# EasyEDA Pro project ESP32_wroom_B.eprj

# Schematic LED_board
Create Date: 2025-08-18; Page Name: P1; Project Name: ESP32_wroom_B; Schematic Name: LED_board; Update Date: 2025-08-20; Company: 嘉立创EDA; Page Size: A4; Version: V1.0
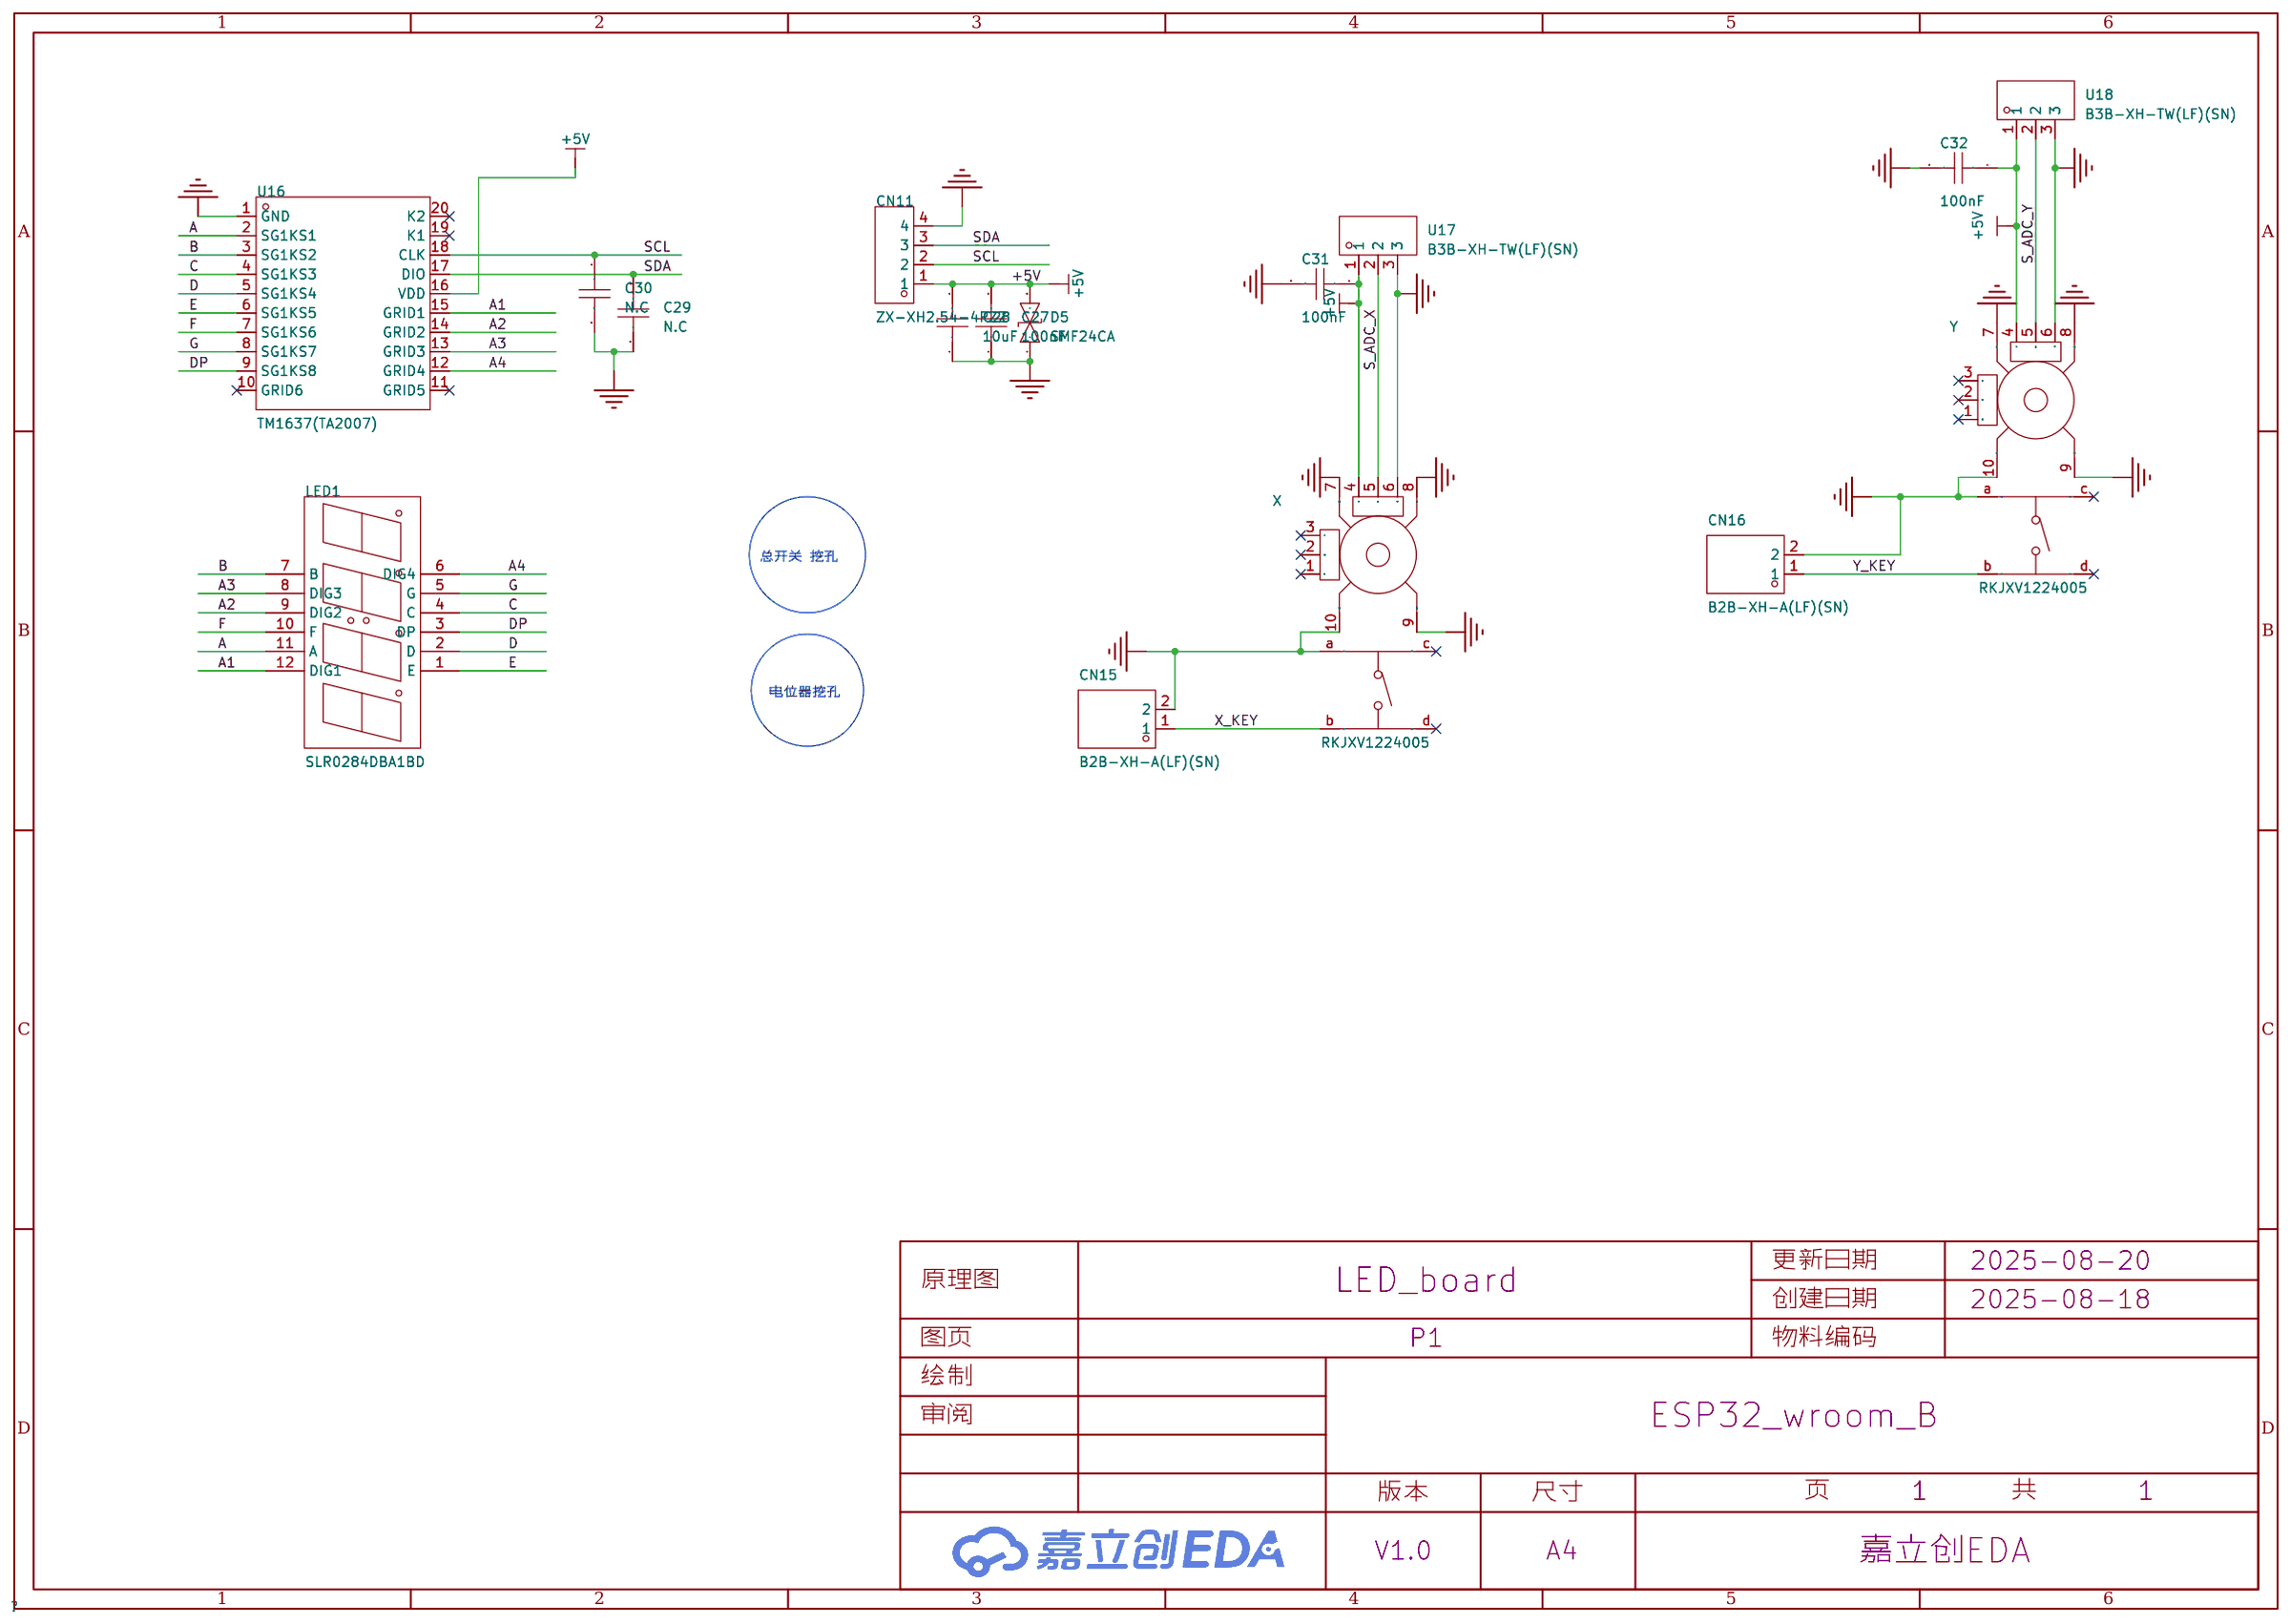
[diagram p0: schematic sheet]

## Parts
C27  100nF  [C0603]
C28  10uF  [C0603]
C29  N.C  [C0603]
C30  N.C  [C0603]
C31  100nF  [C0603]
C32  100nF  [C0603]
CN11  ZX-XH2.54-4PZZ  [CONN-TH_4P-P2.50_4PIN]
CN15  B2B-XH-A(LF)(SN)  [CONN-TH_B2B-XH-A-LF-SN]
CN16  B2B-XH-A(LF)(SN)  [CONN-TH_B2B-XH-A-LF-SN]
D5  SMF24CA  [SOD-123FL_L2.7-W1.8-LS3.8-BI]
LED1  SLR0284DBA1BD  [LED-SEG-TH_12P-L32.1-W10.0-P2.54-S7.62-BL]
U16  TM1637(TA2007)  [SOP-20_L12.8-W7.5-P1.27-LS10.4-BL]
U17  B3B-XH-TW(LF)(SN)  [CONN-TH_B3B-XH-TW-LF-SN]
U18  B3B-XH-TW(LF)(SN)  [CONN-TH_B3B-XH-TW-LF-SN]
X  RKJXV1224005  [SW-TH_RKJXV1224005]
Y  RKJXV1224005  [SW-TH_RKJXV1224005]

## Library data of the parts
C27-C32 = CGA0603X7R104K500JT: 容值:100nF;精度:±10%;额定电压:50V;温度系数:X7R;; LCSC Part Name: 100nF ±10% 50V; Supplier Part: C6119867; Manufacturer: HRE(芯声); Supplier Footprint: 0603; JLCPCB Part Class: 扩展库; Datasheet: https://atta.szlcsc.com/upload/public/pdf/source/20250103/C44077DA9E7B3EFAE02F22B6D3D1CBC9.pdf; Supplier: LCSC; Tolerance: ±10%; Voltage Rating: 50V; Temperature Coefficient: X7R
CN11 = ZX-XH2.54-4PZZ: 插针结构:1x4P;间距:2.5mm;安装方式:直插;参考系列:XH;总PIN数:4P;排数:1;每排PIN数:4;行距:-;额定电流:3A;触头材质:黄铜;触头镀层:锡;工作温度:-25℃~+85℃;; LCSC Part Name: 1x4P 间距:2.5mm 直插 系列:XH; Supplier Part: C7429634; Manufacturer: Megastar(兆星); Supplier Footprint: 插件,P=2.5mm; JLCPCB Part Class: 扩展库; Datasheet: https://item.szlcsc.com/datasheet/ZX-XH2.54-4PZZ/8427551.html; Supplier: LCSC; Pins Structure: 1x4P; Pitch: 2.5mm; Mounting Type: 直插; Reference Series: XH; Number of Pins: 4P; Number of Rows: 1; Number of PINs Per Row: 4; Current Rating: 3A; Contact Material: 黄铜; Contact Plating: 锡; Operating Temperature: -25℃~+85℃; Voltage Rating: 250V; Plastic Material: PA66; Flame Retardant Rating: UL94V-0; Color: 白色; Z-Height of the Board: 7mm; X-Length of Bottom Edge on Board (Spacing Line): 12.5mm; Y-Width of Bottom Edge on Board: 5.9mm
CN15 CN16 = B2B-XH-A(LF)(SN): 插针结构:1x2P;间距:2.5mm;安装方式:直插;参考系列:XH;总PIN数:2P;排数:1;每排PIN数:2;行距:-;额定电流:3A;触头材质:黄铜;触头镀层:锡;工作温度:-25℃~+85℃;; LCSC Part Name: 1x2P 间距:2.5mm 直插 系列:XH; Supplier Part: C158012; Manufacturer: JST; Supplier Footprint: 插件,P=2.5mm; JLCPCB Part Class: 扩展库; Datasheet: https://item.szlcsc.com/datasheet/B2B-XH-A(LF)(SN)/169360.html; Supplier: LCSC; Pins Structure: 1x2P; Pitch: 2.5mm; Mounting Type: 直插; Reference Series: XH; Number of Pins: 2P; Number of Rows: 1; Number of PINs Per Row: 2; Current Rating: 3A; Contact Material: 黄铜; Contact Plating: 锡; Operating Temperature: -25℃~+85℃; Voltage Rating: 250V; Plastic Material: PA66; Flame Retardant Rating: UL94V-0; Supplementary Features: 打K脚; Color: 白色; Z-Height of the Board: 7mm; X-Length of Bottom Edge on Board (Spacing Line): 7.4mm; Y-Width of Bottom Edge on Board: 5.75mm
D5 = SMF24CA_C19077515: 极性:双向;反向截止电压(Vrwm):24V;最大钳位电压:38.9V;峰值脉冲电流(Ipp)@10/1000us:5.1A;峰值脉冲功率(Ppp)@10/1000us:200W;击穿电压:29.5V;; Supplier Part: C19077515; Manufacturer: 宏迦橙; Supplier Footprint: SOD-123FL; JLCPCB Part Class: 扩展库; Datasheet: https://atta.szlcsc.com/upload/public/pdf/source/20231129/4813F17DC56F8B344A8D004597B3633C.pdf; Supplier: LCSC; polarity: 双向; Reverse Stand-Off Voltage (Vrwm): 24V; Maximum Clamping Voltage: 38.9V; Peak Pulse Current (Ipp)@10/1000us: 5.1A; Peak Pulse Power Dissipation (Ppp)@10/1000us: 200W; Breakdown Voltage: 29.5V; Reverse Leakage Current (Ir): 1uA; Operating Temperature: -55℃~+155℃; Type: TVS
LED1 = SLR0284DBA1BD_C2913024: LCSC Part Name: 0.28英寸,四位,蓝光,共阳LED数码管,插件; Supplier Part: C2913024; Manufacturer: SUNLIGHT(光华); Supplier Footprint: 插件; JLCPCB Part Class: 扩展库; Datasheet: https://atta.szlcsc.com/upload/public/pdf/source/20180720/C225887_0F684DEC51BA632F3B2058A569976876.pdf; Supplier: LCSC
U16 = TM1637(TA2007): LCSC Part Name: LED驱动控制专用电路; Supplier Part: C5337160; Manufacturer: TM(天微); Supplier Footprint: SOP-20; JLCPCB Part Class: 扩展库; Datasheet: https://item.szlcsc.com/datasheet/TM1637(TA2007)/6103284.html; Supplier: LCSC
U17 U18 = B3B-XH-TW(LF)(SN): 插针结构:1x3P;间距:2.5mm;安装方式:-;参考系列:XH;总PIN数:3P;排数:1;每排PIN数:3;行距:-;额定电流:3A;工作温度范围:-25℃~+85℃;; LCSC Part Name: 1x3P 间距:2.5mm 系列:XH; Supplier Part: C594199; Manufacturer: JST; Supplier Footprint: P=2.5mm; JLCPCB Part Class: 扩展库; Datasheet: https://atta.szlcsc.com/upload/public/pdf/source/20210915/55C2150F8D01CCBD7F61D7DC07E45ED6.pdf; Supplier: LCSC; Pins Structure: 1x3P; Pitch: 2.5mm; Reference Series: XH; Number of Pins: 3P; Number of Rows: 1; Number of PINs Per Row: 3; Current Rating (Max): 3A; Operating Temperature Range: -25℃~+85℃; Rated Voltage (Max): 250V; Colour: 白色
X Y = RKJXV1224005: 操纵杆复位 中央按动开关 适用于航模玩具遥控器电位器、3D摇杆PS4手柄游戏机、无人机摇杆电位器、工业控制器; Supplier Part: C146170; Manufacturer: ALPSALPINE(阿尔卑斯阿尔派); Supplier Footprint: 插件,13x13mm; JLCPCB Part Class: 扩展库; Datasheet: https://atta.szlcsc.com/upload/public/pdf/source/20180125/C146170_15168615510911301620.pdf; Supplier: LCSC

## Nets
+5V: C27.2 C28.2 C31.1 C32.1 CN11.1 D5.2(A) U16.16(VDD) U17.1 U18.1 X.4(A) Y.4(A)
GND: C27.1 C28.1 C29.2 C30.2 C31.2 C32.2 CN11.4 CN15.2 CN16.2 D5.1(K) U16.1(GND) U17.3 U18.3 X.6(B) X.7(GND) X.8(GND) X.9(GND) X.10(GND) X.a Y.6(B) Y.7(GND) Y.8(GND) Y.9(GND) Y.10(GND) Y.a
A: LED1.11(A) U16.2(SG1KS1)
A1: LED1.12(DIG1) U16.15(GRID1)
A2: LED1.9(DIG2) U16.14(GRID2)
A3: LED1.8(DIG3) U16.13(GRID3)
A4: LED1.6(DIG4) U16.12(GRID4)
B: LED1.7(B) U16.3(SG1KS2)
C: LED1.4(C) U16.4(SG1KS3)
D: LED1.2(D) U16.5(SG1KS4)
DP: LED1.3(DP) U16.9(SG1KS8)
E: LED1.1(E) U16.6(SG1KS5)
F: LED1.10(F) U16.7(SG1KS6)
G: LED1.5(G) U16.8(SG1KS7)
S_ADC_X: U17.2 X.5(DTA)
S_ADC_Y: U18.2 Y.5(DTA)
SCL: C30.1 CN11.2 U16.18(CLK)
SDA: C29.1 CN11.3 U16.17(DIO)
X_KEY: CN15.1 X.b
Y_KEY: CN16.1 Y.b

Not connected (* = marked no-connect by the designer): U16 10(GRID6)* 11(GRID5)* 19(K1)* 20(K2)*; X 1(B)* 2(DTA)* 3(A)* c* d*; Y 1(B)* 2(DTA)* 3(A)* c* d*

## Notes on the sheet
- 总开关 挖孔
- 电位器挖孔

# Board PCB1
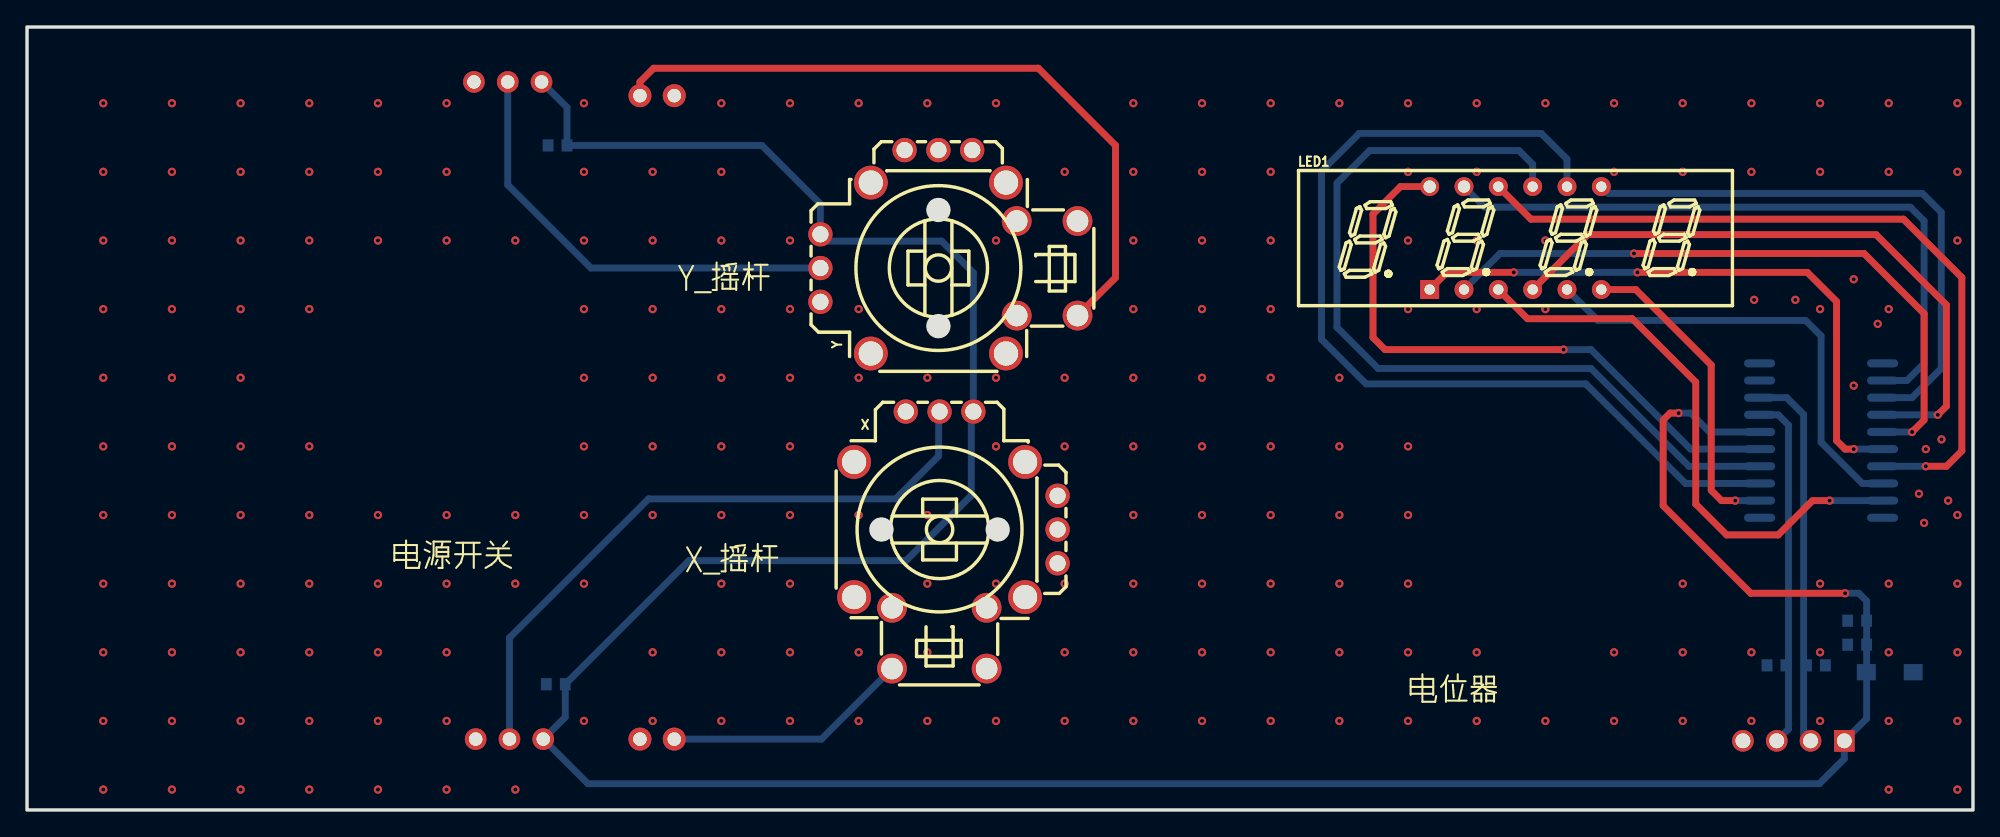
[diagram p1: board, top side]
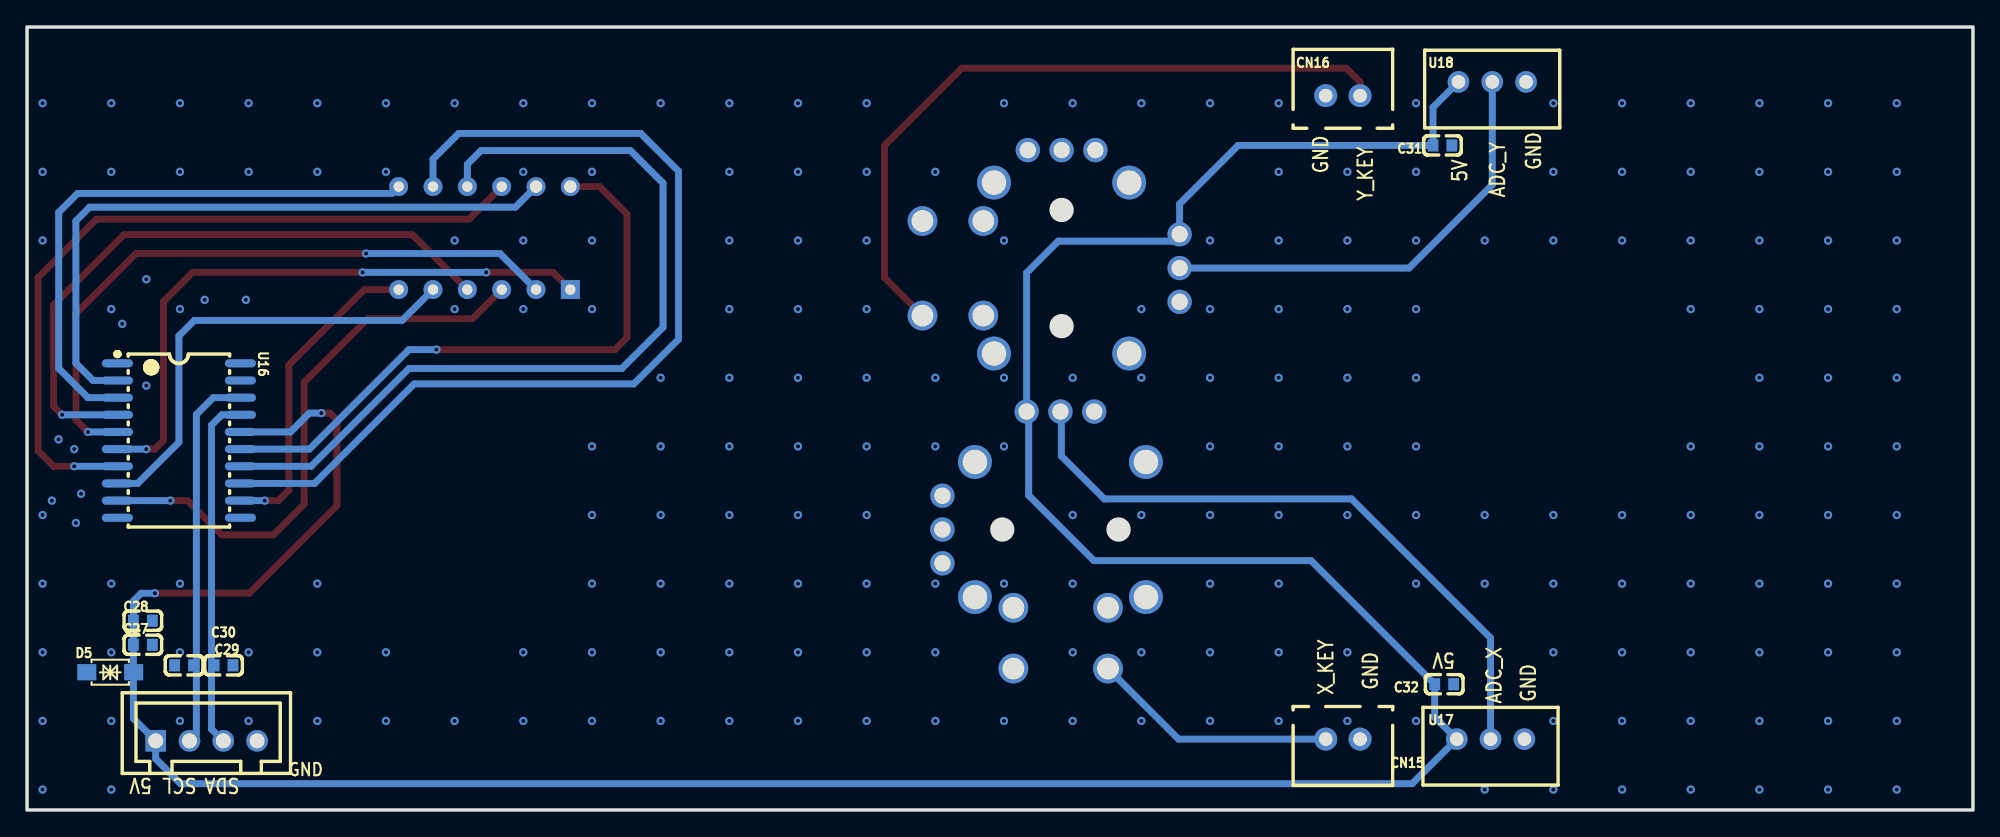
[diagram p2: board, bottom side, seen from below]

Outline 143.95 x 57.95 mm; copper layers: Top Layer, Bottom Layer. Coordinates in mm from the lower left corner of the outline.
Outline path: rectangle 0,57.95 143.95,0
Stack: Top Layer 0.035mm / Dielectric1 1.51mm FR4 er 4.5 / Bottom Layer 0.035mm

## Design rules (mm)
template: 自定义配置
spacing copperThickness1oz (default): track to track 0.102, other pairs 0.152 to 0.508
spacing copperThickness2oz: track to track 0.203, other pairs 0.152 to 0.3
track width copperThickness1oz (default): min 0.127, default 0.254, max 2.54
track width copperThickness2oz: min 0.203, default 0.254, max 2.54
differential pair differentialPair (default): width min 0.127, default 0.254, max 2.54; gap min 0.152, default 0.152
via viaSize (default): diameter min 0.5, default 0.61, max 10; hole min 0.3, default 0.305, max 6.299

## Placement (name value [footprint] x y rotation side)
C27  100nF  [C0603]  135.38 12.23 0 bottom
C28  10uF  [C0603]  135.38 14.01 0 bottom
C29  N.C  [C0603]  129.41 10.71 180 bottom
C30  N.C  [C0603]  132.33 10.71 0 bottom
C31  100nF  [C0603]  39.24 49.19 180 bottom
C32  100nF  [C0603]  39.12 9.31 180 bottom
CN15  B2B-XH-A(LF)(SN)  [CONN-TH_B2B-XH-A-LF-SN]  46.61 5.24 0 bottom
CN16  B2B-XH-A(LF)(SN)  [CONN-TH_B2B-XH-A-LF-SN]  46.61 52.87 180 bottom
D5  SMF24CA  [SOD-123FL_L2.7-W1.8-LS3.8-BI]  137.79 10.2 180 bottom
GND  ZX-XH2.54-4PZZ  [CONN-TH_4P-P2.50_4PIN]  130.68 5.12 180 bottom
LED1  SLR0284DBA1BD  [LED-SEG-TH_12P-L32.1-W10.0-P2.54-S7.62-BL]  110.11 42.33 0 top
U16  TM1637(TA2007)  [SOP-20_L12.8-W7.5-P1.27-LS10.4-BL]  132.72 27.34 270 bottom
U17  B3B-XH-TW(LF)(SN)  [CONN-TH_B3B-XH-TW-LF-SN]  35.69 5.24 180 bottom
U18  B3B-XH-TW(LF)(SN)  [CONN-TH_B3B-XH-TW-LF-SN]  35.56 53.89 180 bottom
X  RKJXV1224005  [SW-TH_RKJXV1224005]  68.71 19.98 0 top
Y  RKJXV1224005  [SW-TH_RKJXV1224005]  68.2 41.31 90 top

## Footprints (pads in the part's own frame, mm; a bottom-side part is the same pattern mirrored in y, then rotated)
C0603
  rect 0.8x0.9 smd: 1(-0.7,0) 2(0.7,0)
CONN-TH_4P-P2.50_4PIN
  rect 1.524x1.6 hole 1.1: 1(-3.75,0)
  round 1.6 hole 1.1: 2(-1.25,0) 3(1.25,0) 4(3.75,0)
CONN-TH_B2B-XH-A-LF-SN
  round 1.7 hole 1: 1(1.27,0) 2(-1.27,0)
CONN-TH_B3B-XH-TW-LF-SN
  round 1.6 hole 1: 1(-2.5,0) 2(0,0) 3(2.5,0)
LED-SEG-TH_12P-L32.1-W10.0-P2.54-S7.62-BL
  rect 1.4x1.4 hole 0.762: 1(-6.35,-3.81)
  round 1.4 hole 0.762: 2(-3.81,-3.81) 3(-1.27,-3.81) 4(1.27,-3.81) 5(3.81,-3.81) 6(6.35,-3.81) 7(6.35,3.81) 8(3.81,3.81) 9(1.27,3.81) 10(-1.27,3.81)
  round 1.4 hole 0.914: 11(-3.81,3.81) 12(-6.35,3.81)
SOD-123FL_L2.7-W1.8-LS3.8-BI
  rect 1.4x1.2 smd: 1(-1.735,0) 2(1.735,0)
SOP-20_L12.8-W7.5-P1.27-LS10.4-BL
  oval 0.6x2.3 smd: 1(-5.715,-4.55) 2(-4.445,-4.55) 3(-3.175,-4.55) 4(-1.905,-4.55) 5(-0.635,-4.55) 6(0.635,-4.55) 7(1.905,-4.55) 8(3.175,-4.55) 9(4.445,-4.55) 10(5.715,-4.55) 11(5.715,4.55) 12(4.445,4.55) 13(3.175,4.55) 14(1.905,4.55) 15(0.635,4.55) 16(-0.635,4.55) 17(-1.905,4.55) 18(-3.175,4.55) 19(-4.445,4.55) 20(-5.715,4.55)
SW-TH_RKJXV1224005
  round 1.8 hole 1.2: 1(7.527,-1.719) 2(7.527,0.781) 3(7.527,3.281) 4(1.298,9.511) 5(-1.202,9.511) 6(-3.703,9.511)
  round 2.5 hole 1.8: 7(-7.527,5.781) 8(-7.527,-4.219) 9(5.122,-4.219) 10(5.122,5.781)
  round 2.2 hole 1.6: a(-4.721,-5.011) b(-4.721,-9.511) c(2.279,-5.011) d(2.279,-9.511)

## Nets
As in the schematic, except:
+5V: C27.2 C28.2 C31.1 C32.1 D5.2 GND.1 U16.16 U17.1 U18.1 X.4 Y.4
GND: C27.1 C28.1 C29.2 C30.2 C31.2 C32.2 CN15.2 CN16.2 D5.1 GND.4 U16.1 U17.3 U18.3 X.6 X.7 X.8 X.9 X.10 X.a Y.6 Y.7 Y.8 Y.9 Y.10 Y.a
SCL: C30.1 GND.2 U16.18
SDA: C29.1 GND.3 U16.17

Pads without a net: U16 10 11 19 20; X 1 2 3 c d; Y 1 2 3 c d

## Via types
v1: diameter 0.61, hole 0.305, Top Layer to Bottom Layer, 22 vias
v2: diameter 0.61, hole 0.304, Top Layer to Bottom Layer, 213 vias

## Routing (per net, layer and track width the routed paths; a pad name or vN(x,y) marks a point on that pad's centre or on a via; arc(x,y) is an arc through that point)
+5V: length 240.8
  Top Layer w0.508: v1(134.49,16.04) 127.51,16.04 121.03,22.52 121.03,28.87 121.54,29.37 v1(122.17,29.37)
  Bottom Layer w0.508: U16.16 124.46,27.98 123.06,29.37 v1(122.17,29.37) ; U18.1 39.94,52 C31.1 54.36,49.19 58.69,44.85 Y.4 59.2,42.1 67.66,42.1 70,39.76 X.4 69.85,29.33 69.85,23.28 65.02,18.45 48.96,18.45 C32.1 39.82,6.87 U17.1 41.49,1.94 132.59,1.94 134.43,3.79 GND.1 136.08,6.77 136.08,15.47 135.51,16.04 v1(134.49,16.04)
GND:
  vias: v1(127.76,37.76) v1(130.81,37.76) v1(135.13,39.28) v1(135.13,31.41) v1(136.91,35.98) v1(139.95,23.41) v1(140.34,21.25) v1(140.46,26.71) v1(141.62,27.43) v1(142.11,22.9) v2(5.64,52.31) v2(5.64,47.23) v2(5.64,42.15) v2(5.64,37.07) v2(5.64,31.99) v2(5.64,26.91) v2(5.64,21.83) v2(5.64,16.75) v2(5.64,11.67) v2(5.64,6.59) v2(5.64,1.51) v2(10.72,52.31) v2(10.72,47.23) v2(10.72,42.15) v2(10.72,37.07) v2(10.72,31.99) v2(10.72,26.91) v2(10.72,21.83) v2(10.72,16.75) v2(10.72,11.67) v2(10.72,6.59) v2(10.72,1.51) v2(15.8,52.31) v2(15.8,47.23) v2(15.8,42.15) v2(15.8,37.07) v2(15.8,31.99) v2(15.8,26.91) v2(15.8,21.83) v2(15.8,16.75) v2(15.8,11.67) v2(15.8,6.59) v2(15.8,1.51) v2(20.88,52.31) v2(20.88,47.23) v2(20.88,42.15) v2(20.88,37.07) v2(20.88,26.91) v2(20.88,21.83) v2(20.88,16.75) v2(20.88,11.67) v2(20.88,6.59) v2(20.88,1.51) v2(25.96,52.31) v2(25.96,47.23) v2(25.96,42.15) v2(25.96,21.83) v2(25.96,16.75) v2(25.96,11.67) v2(25.96,6.59) v2(25.96,1.51) v2(31.04,52.31) v2(31.04,47.23) v2(31.04,42.15) v2(31.04,21.83) v2(31.04,16.75) v2(31.04,11.67) v2(31.04,6.59) v2(31.04,1.51) v2(36.12,42.15) v2(36.12,21.83) v2(36.12,16.75) v2(36.12,1.51) v2(41.2,52.31) v2(41.2,47.23) v2(41.2,42.15) v2(41.2,37.07) v2(41.2,31.99) v2(41.2,26.91) v2(41.2,21.83) v2(41.2,16.75) v2(41.2,6.59) v2(46.28,47.23) v2(46.28,42.15) v2(46.28,37.07) v2(46.28,31.99) v2(46.28,26.91) v2(46.28,21.83) v2(46.28,11.67) v2(46.28,6.59) v2(51.36,52.31) v2(51.36,47.23) v2(51.36,42.15) v2(51.36,37.07) v2(51.36,31.99) v2(51.36,26.91) v2(51.36,21.83) v2(51.36,16.75) v2(51.36,11.67) v2(51.36,6.59) v2(56.44,52.31) v2(56.44,42.15) v2(56.44,37.07) v2(56.44,31.99) v2(56.44,26.91) v2(56.44,21.83) v2(56.44,16.75) v2(56.44,11.67) v2(56.44,6.59) v2(61.52,52.31) v2(61.52,37.07) v2(61.52,31.99) v2(61.52,21.83) v2(61.52,11.67) v2(61.52,6.59) v2(66.6,52.31) v2(66.6,31.99) v2(66.6,21.83) v2(66.6,16.75) v2(66.6,11.67) v2(66.6,6.59) v2(71.68,52.31) v2(71.68,42.15) v2(71.68,31.99) v2(71.68,26.91) v2(71.68,16.75) v2(71.68,6.59) v2(76.76,47.23) v2(76.76,31.99) v2(76.76,26.91) v2(76.76,16.75) v2(76.76,11.67) v2(76.76,6.59) v2(81.84,52.31) v2(81.84,47.23) v2(81.84,42.15) v2(81.84,37.07) v2(81.84,31.99) v2(81.84,26.91) v2(81.84,21.83) v2(81.84,16.75) v2(81.84,11.67) v2(81.84,6.59) v2(86.92,52.31) v2(86.92,47.23) v2(86.92,42.15) v2(86.92,37.07) v2(86.92,31.99) v2(86.92,26.91) v2(86.92,21.83) v2(86.92,16.75) v2(86.92,11.67) v2(86.92,6.59) v2(92,52.31) v2(92,47.23) v2(92,42.15) v2(92,37.07) v2(92,31.99) v2(92,26.91) v2(92,21.83) v2(92,16.75) v2(92,11.67) v2(92,6.59) v2(97.08,52.31) v2(97.08,31.99) v2(97.08,26.91) v2(97.08,21.83) v2(97.08,16.75) v2(97.08,11.67) v2(97.08,6.59) v2(102.16,52.31) v2(102.16,47.23) v2(102.16,42.15) v2(102.16,37.07) v2(102.16,26.91) v2(102.16,21.83) v2(102.16,16.75) v2(102.16,11.67) v2(102.16,6.59) v2(107.24,52.31) v2(107.24,47.23) v2(107.24,42.15) v2(107.24,37.07) v2(107.24,11.67) v2(107.24,6.59) v2(112.32,52.31) v2(112.32,42.15) v2(112.32,37.07) v2(112.32,6.59) v2(117.4,52.31) v2(117.4,47.23) v2(117.4,11.67) v2(117.4,6.59) v2(122.48,52.31) v2(122.48,47.23) v2(122.48,16.75) v2(122.48,11.67) v2(122.48,6.59) v2(127.56,52.31) v2(127.56,47.23) v2(127.56,11.67) v2(127.56,6.59) v2(132.64,52.31) v2(132.64,47.23) v2(132.64,37.07) v2(132.64,16.75) v2(132.64,11.67) v2(132.64,6.59) v2(137.72,52.31) v2(137.72,47.23) v2(137.72,37.07) v2(137.72,16.75) v2(137.72,11.67) v2(137.72,6.59) v2(137.72,1.51) v2(142.8,52.31) v2(142.8,47.23) v2(142.8,42.15) v2(142.8,21.83) v2(142.8,16.75) v2(142.8,11.67) v2(142.8,6.59) v2(142.8,1.51)
A: length 49.2
  Bottom Layer w0.508: LED1.11 107.82,44.61 139.32,44.61 140.34,43.6 140.34,33.06 139.06,31.79 137.26,31.79
A1: length 46.2
  Top Layer w0.508: LED1.12 101.6,46.14 99.57,44.11 99.57,34.96 100.46,34.07 v1(113.66,34.07)
  Bottom Layer w0.508: v1(113.66,34.07) 115.7,34.07 123.06,26.71 U16.15
A2: length 63.7
  Bottom Layer w0.508: U16.14 122.94,25.44 115.7,32.68 99.95,32.68 96.9,35.72 96.9,46.39 99.31,48.81 110.36,48.81 111.38,47.79 LED1.9
A3: length 71.4
  Bottom Layer w0.508: LED1.8 113.92,48.17 112.01,50.08 98.55,50.08 95.76,47.28 95.76,34.84 99.06,31.53 115.32,31.53 122.68,24.17 U16.13
A4: length 23.6
  Top Layer w0.508: v1(126.37,22.9) 125.35,22.9 124.59,23.66 124.59,32.93 119,38.52 LED1.6
  Bottom Layer w0.508: v1(126.37,22.9) U16.12
B: length 42.7
  Bottom Layer w0.508: 137.26,30.52 139.45,30.52 141.6,32.68 141.6,44.23 140.21,45.63 116.97,45.63 LED1.7
C: length 46.9
  Top Layer w0.508: LED1.4 115.44,42.58 136.78,42.58 141.99,37.38 141.99,29.88 v1(141.35,29.25)
  Bottom Layer w0.508: v1(141.35,29.25) 137.26,29.25
D: length 48.3
  Top Layer w0.508: v1(139.45,27.98) 140.34,28.87 140.34,36.74 135.89,41.19 v1(118.87,41.19)
  Bottom Layer w0.508: v1(118.87,41.19) 108.97,41.19 LED1.2 ; v1(139.45,27.98) 137.26,27.98
DP: length 42.3
  Top Layer w0.508: v1(133.35,22.9) 132.08,22.9 129.54,20.36 125.73,20.36 123.44,22.64 123.44,31.66 118.75,36.36 111,36.36 LED1.3
  Bottom Layer w0.508: v1(133.35,22.9) 137.26,22.9
E: length 45.5
  Top Layer w0.508: v1(109.98,39.79) 105.03,39.79 LED1.1 ; v1(119.13,39.79) 131.7,39.79 133.86,37.63 133.86,27.34 134.49,26.71 v1(135.13,26.71)
  Bottom Layer w0.508: v1(119.13,39.79) v1(109.98,39.79) ; v1(135.13,26.71) 137.26,26.71
F: length 56.2
  Top Layer w0.508: v1(140.46,25.44) 141.99,25.44 143.13,26.58 143.13,39.41 138.81,43.73 111.25,43.73 LED1.10
  Bottom Layer w0.508: v1(140.46,25.44) 137.26,25.44
G: length 33.9
  Bottom Layer w0.508: 137.26,24.17 135.76,24.17 132.72,27.22 132.72,35.09 131.57,36.23 116.21,36.23 LED1.5
S_ADC_X: length 48.1
  Bottom Layer w0.508: U17.2 35.69,12.74 45.97,23.02 64.26,23.02 67.44,26.2 67.44,29.42 X.5
S_ADC_Y: length 33.3
  Bottom Layer w0.508: Y.5 41.72,40.11 35.56,46.27 U18.2
SCL: length 28.1
  Bottom Layer w0.508: GND.2 131.43,5.63 131.43,29.27 130.18,30.52 U16.18
SDA: length 26.2
  Bottom Layer w0.508: U16.17 129.54,29.25 130.3,28.49 130.3,5.99 GND.3
X_KEY: length 18.3
  Bottom Layer w0.508: X.b 58.76,5.24 47.88,5.24
Y_KEY: length 52.7
  Top Layer w0.508: CN16.1 45.34,53.89 46.36,54.9 74.8,54.9 80.52,49.19 80.52,39.4 Y.b

## Copper pours and planes (outline as drawn; the poured copper is in the pictures)
GND on Top Layer: 0,57.95 143.95,57.95 143.95,0 0,0
GND on Bottom Layer: 0.25,57.7 143.95,57.7 143.95,0 0.25,0

## Text on the board
Bottom Silkscreen Layer: 5V | SDA | SCL | GND | ADC_Y | ADC_X | Y_KEY | X_KEY
Top Silkscreen Layer: 电源开关 | Y_摇杆 | X_摇杆 | 电位器
